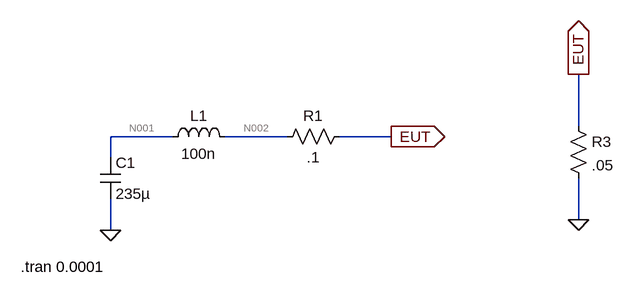
[diagram p0: schematic 8x20 - Single Capacitor.asc]
8x20 - Single Capacitor.asc, the LTspice schematic file:
Version 4
SHEET 1 880 680
WIRE 768 80 768 0
WIRE 144 96 48 96
WIRE 320 96 224 96
WIRE 480 96 400 96
WIRE 48 128 48 96
WIRE 768 224 768 160
WIRE 48 240 48 192
FLAG 48 240 0
FLAG 480 96 EUT
IOPIN 480 96 Out
FLAG 768 0 EUT
IOPIN 768 0 Out
FLAG 768 224 0
SYMBOL cap 32 128 R0
SYMATTR InstName C1
SYMATTR Value 235µ
SYMATTR SpiceLine IC=5000
SYMBOL ind 128 112 R270
WINDOW 0 32 56 VTop 2
WINDOW 3 5 56 VBottom 2
SYMATTR InstName L1
SYMATTR Value 100n
SYMBOL res 416 80 R90
WINDOW 0 0 56 VBottom 2
WINDOW 3 32 56 VTop 2
SYMATTR InstName R1
SYMATTR Value .1
SYMBOL res 752 64 R0
SYMATTR InstName R3
SYMATTR Value .05
TEXT -90 296 Left 2 !.tran 0.0001

The netlist it stands for:
* 8x20 - Single Capacitor.asc
C1 N001 0 235µ IC=5000
L1 N001 N002 100n
R1 EUT N002 .1
R3 EUT 0 .05
.tran 0.0001
.backanno
.end

* Results of the author's LTspice run, read from the files saved beside the schematic
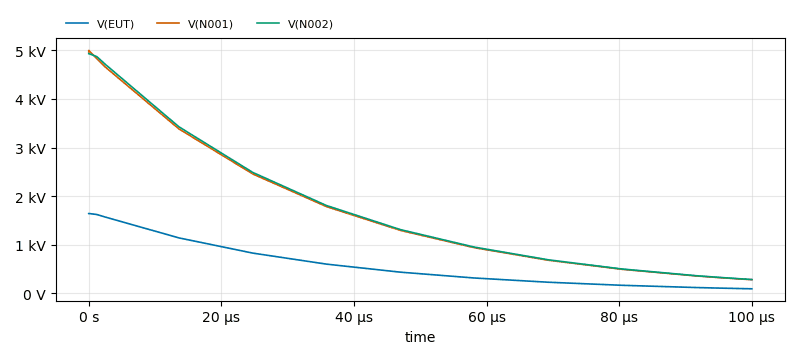
[diagram p1: Transient Analysis of 8x20 - Single Capacitor.asc, plotted from the saved traces]
* Transient Analysis, 1 run:
*   V(EUT): min 95.48 V, max 1.645 kV, average 558.4 V, rms 712.6 V, last 95.48 V
*   V(N001): min 282.9 V, max 5 kV, average 1.656 kV, rms 2.114 kV, last 282.9 V
*   V(N002): min 286.4 V, max 4.934 kV, average 1.675 kV, rms 2.138 kV, last 286.4 V